# Altium schematic sheet Sheet3.SchDoc
size A4
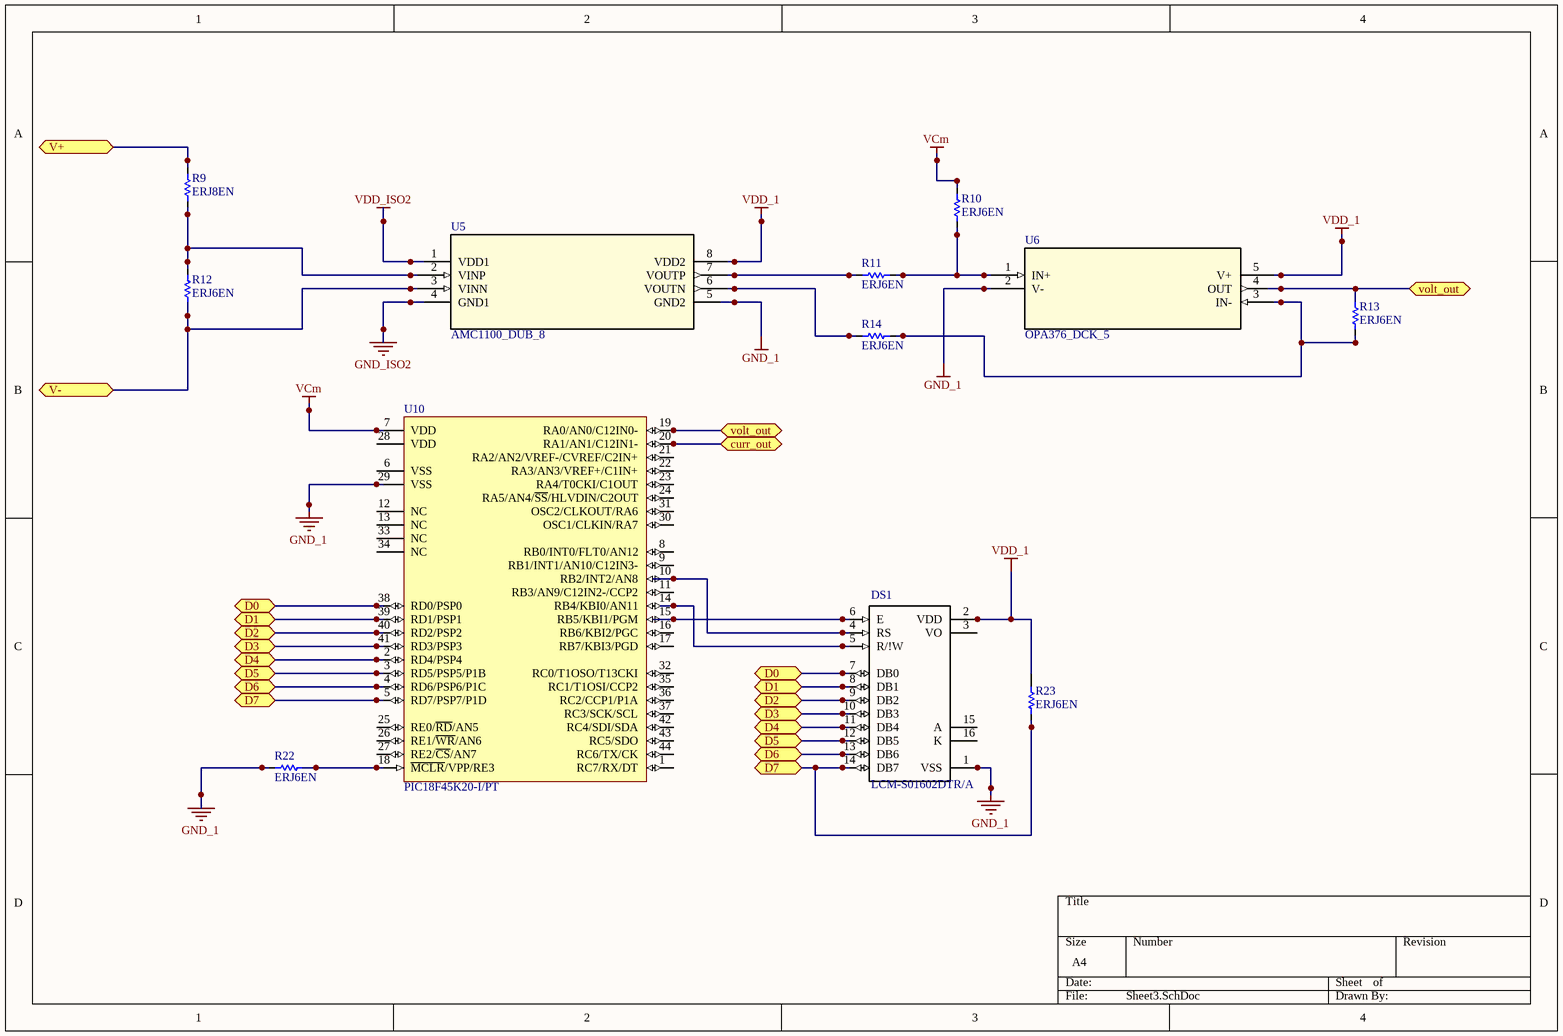
[diagram p0: Sheet3.SchDoc]

## Parts
DS1  LCM-S01602DTR/A  [LCD_LCM-S01602DTR/A]
R9  ERJ8EN  [8-1206]
R10  ERJ6EN  [6-0805]
R11  ERJ6EN  [6-0805]
R12  ERJ6EN  [6-0805]
R13  ERJ6EN  [6-0805]
R14  ERJ6EN  [6-0805]
R22  ERJ6EN  [6-0805]
R23  ERJ6EN  [6-0805]
U5  AMC1100_DUB_8  [DUB8]
U6  OPA376_DCK_5  [DCK5]
U10  PIC18F45K20-I/PT  [TQFP-PT44_N]

## Ports
curr_out, D0, D1, D2, D3, D4, D5, D6, D7, V+, V-, volt_out

## Nets
GND_1: DS1.1(VSS) R22.1 U5.5(GND2) U6.2(V-) U10.29(VSS)
GND_ISO2: U5.4(GND1)
VCm: R10.2 U10.7(VDD)
VDD_1: DS1.2(VDD) R23.2 U5.8(VDD2) U6.5(V+)
VDD_ISO2: U5.1(VDD1)
curr_out: U10.20(RA1/AN1/C12IN1-) ; port curr_out
D0: DS1.7(DB0) U10.38(RD0/PSP0) ; port D0
D1: DS1.8(DB1) U10.39(RD1/PSP1) ; port D1
D2: DS1.9(DB2) U10.40(RD2/PSP2) ; port D2
D3: DS1.10(DB3) U10.41(RD3/PSP3) ; port D3
D4: DS1.11(DB4) U10.2(RD4/PSP4) ; port D4
D5: DS1.12(DB5) U10.3(RD5/PSP5/P1B) ; port D5
D6: DS1.13(DB6) U10.4(RD6/PSP6/P1C) ; port D6
D7: DS1.14(DB7) R23.1 U10.5(RD7/PSP7/P1D) ; port D7
V+: R9.2 ; port V+
V-: R12.1 U5.3(VINN) ; port V-
volt_out: R13.2 U6.4(OUT) U10.19(RA0/AN0/C12IN0-) ; port volt_out
NetDS1_4: DS1.4(RS) U10.10(RB2/INT2/AN8)
NetDS1_5: DS1.5(R/!W) U10.14(RB4/KBI0/AN11)
NetDS1_6: DS1.6(E) U10.15(RB5/KBI1/PGM)
NetR9_1: R9.1 R12.2 U5.2(VINP)
NetR10_1: R10.1 R11.2 U6.1(IN+)
NetR11_1: R11.1 U5.7(VOUTP)
NetR13_1: R13.1 R14.1 U6.3(IN-)
NetR14_2: R14.2 U5.6(VOUTN)
NetR22_2: R22.2 U10.18(~{MCLR}/VPP/RE3)

Not connected (* = marked no-connect by the designer): DS1 3(VO) 15(A) 16(K); U10 1(RC7/RX/DT) 6(VSS) 8(RB0/INT0/FLT0/AN12) 9(RB1/INT1/AN10/C12IN3-) 11(RB3/AN9/C12IN2-/CCP2) 12(NC) 13(NC) 16(RB6/KBI2/PGC) 17(RB7/KBI3/PGD) 21(RA2/AN2/VREF-/CVREF/C2IN+) 22(RA3/AN3/VREF+/C1IN+) 23(RA4/T0CKI/C1OUT) 24(RA5/AN4/~{SS}/HLVDIN/C2OUT) 25(RE0/~{RD}/AN5) 26(RE1/~{WR}/AN6) 27(RE2/~{CS}/AN7) 28(VDD) 30(OSC1/CLKIN/RA7) 31(OSC2/CLKOUT/RA6) 32(RC0/T1OSO/T13CKI) 33(NC) 34(NC) 35(RC1/T1OSI/CCP2) 36(RC2/CCP1/P1A) 37(RC3/SCK/SCL) 42(RC4/SDI/SDA) 43(RC5/SDO) 44(RC6/TX/CK)

## Library data of the parts
DS1 = LCM-S01602DTR/A: Module, LCD; 16 x 2 mm; 5 x 8; 5 V (Typ.); 2 mA (Typ.); 4.2 V @50 degC (Min.); MF: Lumex; SnapEDA_Link: https://www.snapeda.com/parts/LCM-S01602DTR/A/Lumex%20Opto/Components%20Inc/view-part/?ref=snap; MP: LCM-S01602DTR/A; Package: None; Price: 7.47 USD; Availability: Warning; Value: *
R9 = ERJ8EN: Precision Thick Film Chip Resistor, 10 Ohm to 2.2M Ohm Range, 1% Tolerance, 1206 Size, 0.125 W; Published: 17-Dec-2003; LatestRevisionDate: 19-Mar-2004; LatestRevisionNote: Silkscreen size reduced.; PackageDocument: Mar-2003; PackageReference: 8-1206; Publisher: Altium Limited; Code_IPC: 3216 [1206]; ComponentLink1Description: Manufacturer Link; ComponentLink1URL: http://www.panasonic.com/industrial/components/resistive_products.htm; ComponentLink2Description: Datasheet; ComponentLink2URL: http://www.panasonic.com/industrial/components/pdf/AOA0000CE2.pdf
R10-R14 R22 R23 = ERJ6EN: Precision Thick Film Chip Resistor, 10 Ohm to 2.2M Ohm Range, 1% Tolerance, 0805 Size, 0.1 W; Published: 17-Dec-2003; LatestRevisionDate: 19-Mar-2004; LatestRevisionNote: Silkscreen size reduced.; PackageDocument: Mar-2003; PackageReference: 6-0805; Publisher: Altium Limited; Code_IPC: 2012 [0805]; ComponentLink1Description: Manufacturer Link; ComponentLink1URL: http://www.panasonic.com/industrial/components/resistive_products.htm; ComponentLink2Description: Datasheet; ComponentLink2URL: http://www.panasonic.com/industrial/components/pdf/AOA0000CE2.pdf
U5 = AMC1100_DUB_8: Imported; Manufacturer: Texas Instruments; GENERIC_PART_NUMBER: AMC1200; INDUSTRY_STD_PKG_TYPE: SOP; FAMILY_NAME: ISOLATED ADC; PIN_COUNT: 8; PACKAGE_DESIGNATOR: DUB; Datasheet_URL: http://www.ti.com/lit/gpn/AMC1200; Value: Value; Type: Type; RefDes: RefDes
U6 = OPA376_DCK_5: Imported; Manufacturer: Texas Instruments; GENERIC_PART_NUMBER: OPA376; INDUSTRY_STD_PKG_TYPE: SC70; FAMILY_NAME: LOW OFFSET VOLTAGE; PIN_COUNT: 5; PACKAGE_DESIGNATOR: DCK; Datasheet_URL: http://www.ti.com/lit/gpn/OPA376; Vendor: Texas Instruments; Manufacturer_Part_Number: opa376_dck_5; Value: Value; Type: Type; RefDes: RefDes
U10 = PIC18F45K20-I/PT: Flash Microcontroller with 10-Bit A/D and nanoWatt Technology, 32K Flash, 44-Pin TQFP, Industrial Temperature Range; Published: 29-Jan-2009; LatestRevisionDate: 02-Dec-2009; LatestRevisionNote: Updated to datasheet revision F, Sep-2009; DatasheetVersion: revF, Sep-2009; PackageVersion: revBB, Aug-2009; PackageReference: TQFP-PT44; Publisher: Altium Limited; PackageDescription: 44-Lead Plastic Thin Quad Flatpack (PT) - 10x10x1mm Body, 2.00mm [TQFP]; Supplier 1: Digi-Key; Supplier Part Number 1: PIC18F45K20-I/PT-ND; Supplier 2: Farnell; Supplier Part Number 2: 1439589; Code_JEDEC: MS-026; ComponentLink1Description: Datasheet; ComponentLink1URL: http://ww1.microchip.com/downloads/en/DeviceDoc/41303F.pdf; ComponentLink2Description: Packaging Specification; ComponentLink2URL: http://www.microchip.com/stellent/groups/techpub_sg/documents/packagingspec/en012702.pdf; ComponentLink3Description: Microchip.com Home; ComponentLink3URL: http://www.microchip.com/